# Altium schematic sheet Power.SchDoc
size A4
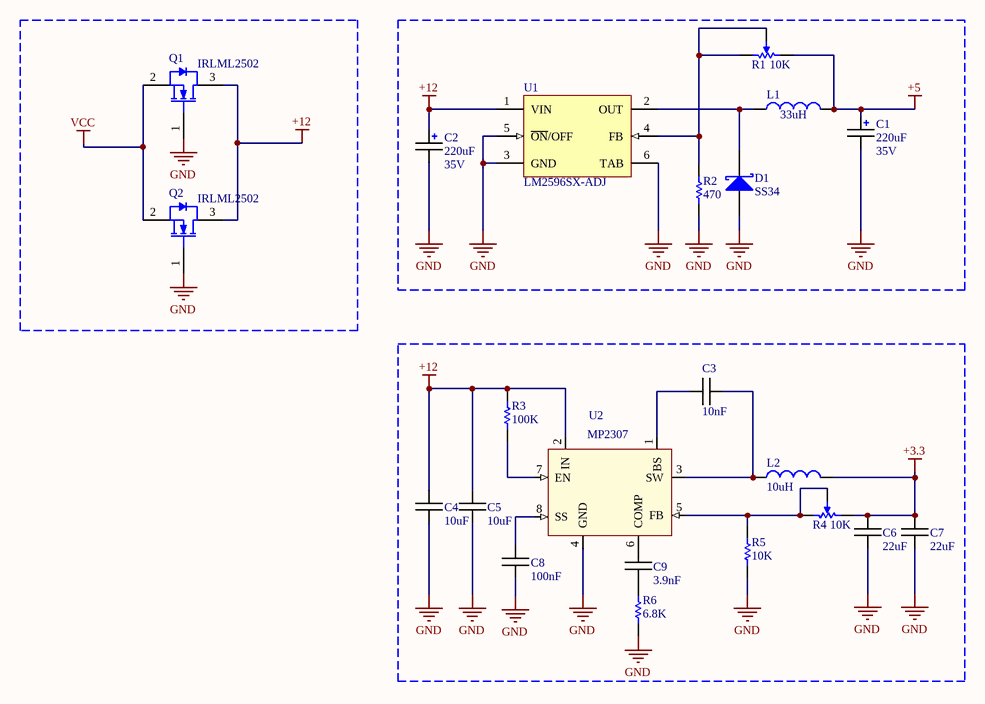
[diagram p0: Power.SchDoc]

## Parts
C1  Rated Capacitance: 220uF  Rated Voltage: 35V  [ECAP_SMD_8mmx10mm]  (hidden comment: CAP_ELEC_SMD)
C2  Rated Capacitance: 220uF  Rated Voltage: 35V  [ECAP_SMD_8mmx10mm]  (hidden comment: CAP_ELEC_SMD)
C3  Val: 10nF  [CAP0805]  (hidden comment: CAP_SMD)
C4  Val: 10uF  [CAPC1206(3216)170_L]  (hidden comment: CAP_SMD)
C5  Val: 10uF  [CAPC1206(3216)170_L]  (hidden comment: CAP_SMD)
C6  Val: 22uF  [CAPC1206(3216)170_L]  (hidden comment: CAP_SMD)
C7  Val: 22uF  [CAPC1206(3216)170_L]  (hidden comment: CAP_SMD)
C8  Val: 100nF  [CAP0805]  (hidden comment: CAP_SMD)
C9  Val: 3.9nF  [CAP0805]  (hidden comment: CAP_SMD)
D1  SS34  [DO-214]
L1  Inductance: 33uH  [SDR1006_SMD]
L2  value 10uH  [IHLP2525]  (hidden comment: Inductor power)
Q1  IRLML2502  [SOT23_L]
Q2  IRLML2502  [SOT23_L]
R1  value 10K  [BOUR-3296W]  (hidden comment: 3296W)
R2  Val: 470  [RES0805]  (hidden comment: RES_SMD)
R3  Val: 100K  [RES0805]  (hidden comment: RES_SMD)
R4  value 10K  [BOUR-3296W]  (hidden comment: 3296W)
R5  Val: 10K  [RES0805]  (hidden comment: RES_SMD)
R6  Val: 6.8K  [RES0805]  (hidden comment: RES_SMD)
U1  LM2596SX-ADJ  [KTT0005B_N]
U2  MP2307  [SOIC8N]

## Nets
+3.3: C6.2 C7.2 L2.2 R4.3
+5: C1.1 L1.2 R1.3
+12: C2.1 C4.2 C5.2 Q1.3(D) Q2.3(D) R3.2 U1.1(VIN) U2.2(IN)
GND: C1.2 C2.2 C4.1 C5.1 C6.1 C7.1 C8.1 D1.2(A) Q1.1(G) Q2.1(G) R2.1 R5.1 R6.1 U1.3(GND) U1.5(~{ON}/OFF) U1.6(TAB) U2.4(GND)
VCC: Q1.2(S) Q2.2(S)
NetC3_1: C3.1 U2.1(BS)
NetC3_2: C3.2 L2.1 U2.3(SW)
NetC8_2: C8.2 U2.8(SS)
NetC9_1: C9.1 R6.2
NetC9_2: C9.2 U2.6(COMP)
NetD1_1: D1.1(K) L1.1 U1.2(OUT)
NetR1_1: R1.1 R1.2 R2.2 U1.4(FB)
NetR3_1: R3.1 U2.7(EN)
NetR4_1: R4.1 R4.2 R5.2 U2.5(FB)

## Library data of the parts
C3-C9 = CAP_SMD: Ceramic capacitor, 0805
D1 = SS34: Schottky Rectifier
L1 = Inductor power: Inductor for Power Circuits; Manufacturer: TDK; Online Catalog: VLCFSeries; Catalog Drawings: VLCF50[20,20-(1,3),28-2]SeriesTopVLCF50[20,20-(1,3),28-2]SeriesFootprintVLCF50[20,20-(1,3)]SeriesSide; Current - Saturation: 2.62A; Frequency - Test: 100kHz; EDA / CAD Models: DownloadfromAcceleratedDesigns; Material - Core: Ferrite; Type: Wirewound; DC Resistance (DCR): 43mOhmMax; Tolerance: ±30%; Shielding: Shielded; Other Names: 445-4557-1; Size / Dimension: 0.197"Lx0.197"W(5.00mmx5.00mm); Datasheet Version: 04/2016; Package Description: 2-Pin Surface Mount Device, Body 5 x 5 mm; Package Reference: VLCF5020T-3; Package / Case: Nonstandard; Series: VLCF; Current Rating: 2.62A; Manufacturer URL: http://www.tdk.com/; Category: Inductors,Coils,Chokes; Height - Seated (Max): 0.079"(2.00mm); Mounting Technology: SurfaceMount; Family: FixedInductors; Datasheet URL: https://product.tdk.com/info/en/catalog/datasheets/inductor_commercial_power_vlcf5020-3_en.pdf; Standard Package: 1; Mounting Type: SurfaceMount; Operating Temperature: -40°C~105°C; Packaging: CutTape(CT)
L2 = Inductor power: Inductor for Power Circuits
Q1 Q2 = IRLML2502: N-Channel HEXFET(R) Power MOSFET, 20 V VDS, +/- 12 V VGS, 4.2 A, 3-Pin SOT23, RoHS, Tape and Reel; Manufacturer: International Rectifier; Drain-to-Source Voltage [Vdss]: 20V; Drain-Source On Resistance-Max: 0.045O; Qg Gate Charge: 8nC; Rated Power Dissipation: 1.25W; Package Reference: SOT-23-3; Manufacturer URL: http://internationalrectifier.com/; Package Description: 3-Pin Small Outline Transistor, Body 2.92 x 1.3 mm, Pitch 0.95 mm; Datasheet Version: Apr-14; Channel Type: N-Channel; Datasheet URL: https://datasheet.ciiva.com/6383/irlml2502pbf-6383216.pdf
R1 R4 = Potentiometer: 3296 - 3/8 ” Square Trimpot(R) Trimming Potentiometer,, +/- 10%, 0.5 W, -55 to 125 degC, 3-Pin THD, RoHS, Tube
U1 = LM2596SX-ADJ: SIMPLE SWITCHER® Power Converter 150 KHz 3A Step-Down Voltage Regulator, 5-pin TO-263; Manufacturer: Texas Instruments; PackageTopMarking: NSUZXYTTE#*LM2596S*-ADJ P+; PowerWise: N; PackageDescription: TO-263, Molded, .400 x .390 x .180in, 5 Lead, .067in Pitch, Surface Mount; RoHS: N; Code_JEDEC: MO-169-AB; CompType: Switcher; ComponentLink1Description: Datasheet URL; PackageReference: KTT0005B; PinCount: 5; ComponentLink1URL: http://www.ti.com/general/docs/lit/getliterature.tsp?genericPartNumber=LM2596&fileType=pdf
U2 = MP2307: Monolithic synchronous buck regulator